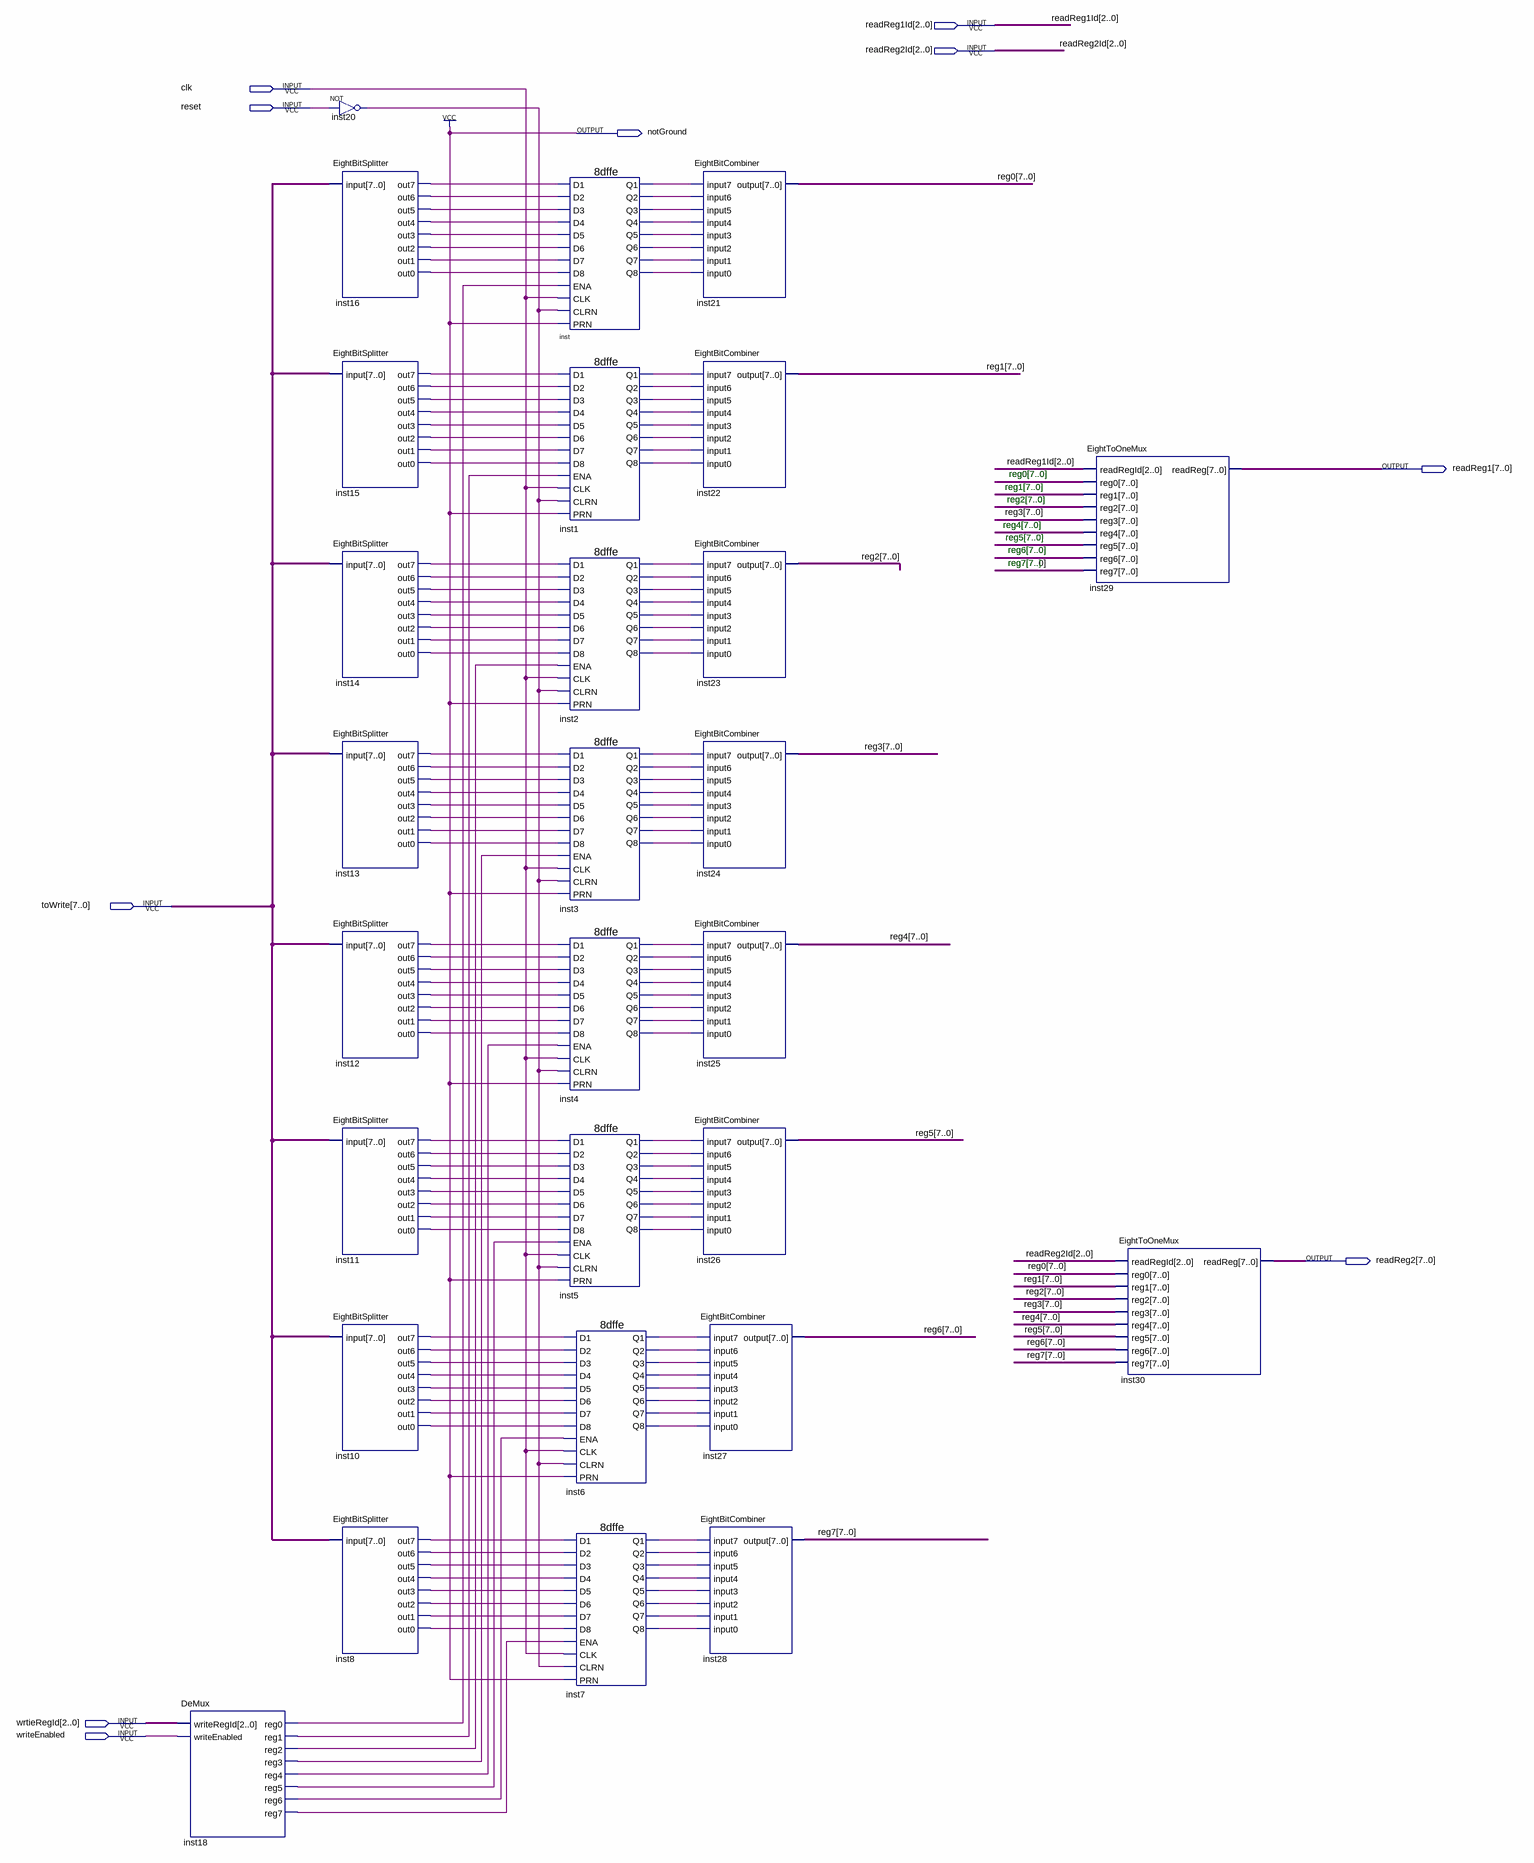
[diagram p0: schematic sheet]
// Quartus schematic RegisterFile.bdf as structural Verilog: 28 symbols, 10 pins
module RegisterFile (
  input  [2:0] readReg1Id,
  input  [2:0] readReg2Id,
  input  clk,
  input  reset,
  input  [7:0] toWrite,
  input  [2:0] wrtieRegId,
  input  writeEnabled,
  output notGround,
  output [7:0] readReg1,
  output [7:0] readReg2
);

  wire inst1_q1, inst1_q2, inst1_q3, inst1_q4, inst1_q5, inst1_q6, inst1_q7, inst1_q8, inst2_q1, inst2_q2,
       inst2_q3, inst2_q4, inst2_q5, inst2_q6, inst2_q7, inst2_q8, inst3_q1, inst3_q2, inst3_q3, inst3_q4,
       inst3_q5, inst3_q6, inst3_q7, inst3_q8, inst4_q1, inst4_q2, inst4_q3, inst4_q4, inst4_q5, inst4_q6,
       inst4_q7, inst4_q8, inst5_q1, inst5_q2, inst5_q3, inst5_q4, inst5_q5, inst5_q6, inst5_q7, inst5_q8,
       inst6_q1, inst6_q2, inst6_q3, inst6_q4, inst6_q5, inst6_q6, inst6_q7, inst6_q8, inst7_q1, inst7_q2,
       inst7_q3, inst7_q4, inst7_q5, inst7_q6, inst7_q7, inst7_q8, inst8_out0, inst8_out1, inst8_out2,
       inst8_out3, inst8_out4, inst8_out5, inst8_out6, inst8_out7, inst10_out0, inst10_out1, inst10_out2,
       inst10_out3, inst10_out4, inst10_out5, inst10_out6, inst10_out7, inst11_out0, inst11_out1,
       inst11_out2, inst11_out3, inst11_out4, inst11_out5, inst11_out6, inst11_out7, inst12_out0,
       inst12_out1, inst12_out2, inst12_out3, inst12_out4, inst12_out5, inst12_out6, inst12_out7,
       inst13_out0, inst13_out1, inst13_out2, inst13_out3, inst13_out4, inst13_out5, inst13_out6,
       inst13_out7, inst14_out0, inst14_out1, inst14_out2, inst14_out3, inst14_out4, inst14_out5,
       inst14_out6, inst14_out7, inst15_out0, inst15_out1, inst15_out2, inst15_out3, inst15_out4,
       inst15_out5, inst15_out6, inst15_out7, inst16_out0, inst16_out1, inst16_out2, inst16_out3,
       inst16_out4, inst16_out5, inst16_out6, inst16_out7, inst18_reg0, inst18_reg1, inst18_reg2,
       inst18_reg3, inst18_reg4, inst18_reg5, inst18_reg6, inst18_reg7, inst20_out, inst_q1, inst_q2,
       inst_q3, inst_q4, inst_q5, inst_q6, inst_q7, inst_q8;
  wire [7:0] reg0, reg1, reg2, reg3, reg4, reg5, reg6, reg7;

  DeMux inst18 (
    .writeRegId(wrtieRegId), .writeEnabled(writeEnabled), .reg0(inst18_reg0), .reg1(inst18_reg1),
    .reg2(inst18_reg2), .reg3(inst18_reg3), .reg4(inst18_reg4), .reg5(inst18_reg5), .reg6(inst18_reg6),
    .reg7(inst18_reg7));
  not inst20 (inst20_out, reset);
  EightBitSplitter inst16 (
    .\input (toWrite), .out7(inst16_out7), .out6(inst16_out6), .out5(inst16_out5), .out4(inst16_out4),
    .out3(inst16_out3), .out2(inst16_out2), .out1(inst16_out1), .out0(inst16_out0));
  EightBitSplitter inst15 (
    .\input (toWrite), .out7(inst15_out7), .out6(inst15_out6), .out5(inst15_out5), .out4(inst15_out4),
    .out3(inst15_out3), .out2(inst15_out2), .out1(inst15_out1), .out0(inst15_out0));
  EightBitSplitter inst14 (
    .\input (toWrite), .out7(inst14_out7), .out6(inst14_out6), .out5(inst14_out5), .out4(inst14_out4),
    .out3(inst14_out3), .out2(inst14_out2), .out1(inst14_out1), .out0(inst14_out0));
  EightBitSplitter inst13 (
    .\input (toWrite), .out7(inst13_out7), .out6(inst13_out6), .out5(inst13_out5), .out4(inst13_out4),
    .out3(inst13_out3), .out2(inst13_out2), .out1(inst13_out1), .out0(inst13_out0));
  EightBitSplitter inst12 (
    .\input (toWrite), .out7(inst12_out7), .out6(inst12_out6), .out5(inst12_out5), .out4(inst12_out4),
    .out3(inst12_out3), .out2(inst12_out2), .out1(inst12_out1), .out0(inst12_out0));
  EightBitSplitter inst11 (
    .\input (toWrite), .out7(inst11_out7), .out6(inst11_out6), .out5(inst11_out5), .out4(inst11_out4),
    .out3(inst11_out3), .out2(inst11_out2), .out1(inst11_out1), .out0(inst11_out0));
  EightBitSplitter inst10 (
    .\input (toWrite), .out7(inst10_out7), .out6(inst10_out6), .out5(inst10_out5), .out4(inst10_out4),
    .out3(inst10_out3), .out2(inst10_out2), .out1(inst10_out1), .out0(inst10_out0));
  EightBitSplitter inst8 (
    .\input (toWrite), .out7(inst8_out7), .out6(inst8_out6), .out5(inst8_out5), .out4(inst8_out4),
    .out3(inst8_out3), .out2(inst8_out2), .out1(inst8_out1), .out0(inst8_out0));
  \8dffe  inst (
    .CLRN(inst20_out), .D2(inst16_out6), .D3(inst16_out5), .D4(inst16_out4), .D5(inst16_out3),
    .D8(inst16_out0), .D6(inst16_out2), .D7(inst16_out1), .CLK(clk), .ENA(inst18_reg0), .D1(inst16_out7),
    .PRN(1'b1), .Q8(inst_q8), .Q4(inst_q4), .Q6(inst_q6), .Q7(inst_q7), .Q3(inst_q3), .Q2(inst_q2),
    .Q1(inst_q1), .Q5(inst_q5));
  \8dffe  inst1 (
    .CLRN(inst20_out), .D2(inst15_out6), .D3(inst15_out5), .D4(inst15_out4), .D5(inst15_out3),
    .D8(inst15_out0), .D6(inst15_out2), .D7(inst15_out1), .CLK(clk), .ENA(inst18_reg1), .D1(inst15_out7),
    .PRN(1'b1), .Q8(inst1_q8), .Q4(inst1_q4), .Q6(inst1_q6), .Q7(inst1_q7), .Q3(inst1_q3), .Q2(inst1_q2),
    .Q1(inst1_q1), .Q5(inst1_q5));
  \8dffe  inst2 (
    .CLRN(inst20_out), .D2(inst14_out6), .D3(inst14_out5), .D4(inst14_out4), .D5(inst14_out3),
    .D8(inst14_out0), .D6(inst14_out2), .D7(inst14_out1), .CLK(clk), .ENA(inst18_reg2), .D1(inst14_out7),
    .PRN(1'b1), .Q8(inst2_q8), .Q4(inst2_q4), .Q6(inst2_q6), .Q7(inst2_q7), .Q3(inst2_q3), .Q2(inst2_q2),
    .Q1(inst2_q1), .Q5(inst2_q5));
  \8dffe  inst3 (
    .CLRN(inst20_out), .D2(inst13_out6), .D3(inst13_out5), .D4(inst13_out4), .D5(inst13_out3),
    .D8(inst13_out0), .D6(inst13_out2), .D7(inst13_out1), .CLK(clk), .ENA(inst18_reg3), .D1(inst13_out7),
    .PRN(1'b1), .Q8(inst3_q8), .Q4(inst3_q4), .Q6(inst3_q6), .Q7(inst3_q7), .Q3(inst3_q3), .Q2(inst3_q2),
    .Q1(inst3_q1), .Q5(inst3_q5));
  \8dffe  inst4 (
    .CLRN(inst20_out), .D2(inst12_out6), .D3(inst12_out5), .D4(inst12_out4), .D5(inst12_out3),
    .D8(inst12_out0), .D6(inst12_out2), .D7(inst12_out1), .CLK(clk), .ENA(inst18_reg4), .D1(inst12_out7),
    .PRN(1'b1), .Q8(inst4_q8), .Q4(inst4_q4), .Q6(inst4_q6), .Q7(inst4_q7), .Q3(inst4_q3), .Q2(inst4_q2),
    .Q1(inst4_q1), .Q5(inst4_q5));
  \8dffe  inst5 (
    .CLRN(inst20_out), .D2(inst11_out6), .D3(inst11_out5), .D4(inst11_out4), .D5(inst11_out3),
    .D8(inst11_out0), .D6(inst11_out2), .D7(inst11_out1), .CLK(clk), .ENA(inst18_reg5), .D1(inst11_out7),
    .PRN(1'b1), .Q8(inst5_q8), .Q4(inst5_q4), .Q6(inst5_q6), .Q7(inst5_q7), .Q3(inst5_q3), .Q2(inst5_q2),
    .Q1(inst5_q1), .Q5(inst5_q5));
  \8dffe  inst6 (
    .CLRN(inst20_out), .D2(inst10_out6), .D3(inst10_out5), .D4(inst10_out4), .D5(inst10_out3),
    .D8(inst10_out0), .D6(inst10_out2), .D7(inst10_out1), .CLK(clk), .ENA(inst18_reg6), .D1(inst10_out7),
    .PRN(1'b1), .Q8(inst6_q8), .Q4(inst6_q4), .Q6(inst6_q6), .Q7(inst6_q7), .Q3(inst6_q3), .Q2(inst6_q2),
    .Q1(inst6_q1), .Q5(inst6_q5));
  \8dffe  inst7 (
    .CLRN(inst20_out), .D2(inst8_out6), .D3(inst8_out5), .D4(inst8_out4), .D5(inst8_out3), .D8(inst8_out0),
    .D6(inst8_out2), .D7(inst8_out1), .CLK(clk), .ENA(inst18_reg7), .D1(inst8_out7), .PRN(1'b1),
    .Q8(inst7_q8), .Q4(inst7_q4), .Q6(inst7_q6), .Q7(inst7_q7), .Q3(inst7_q3), .Q2(inst7_q2), .Q1(inst7_q1),
    .Q5(inst7_q5));
  EightBitCombiner inst21 (
    .input7(inst_q1), .input6(inst_q2), .input5(inst_q3), .input4(inst_q4), .input3(inst_q5),
    .input2(inst_q6), .input1(inst_q7), .input0(inst_q8), .\output (reg0));
  EightBitCombiner inst22 (
    .input7(inst1_q1), .input6(inst1_q2), .input5(inst1_q3), .input4(inst1_q4), .input3(inst1_q5),
    .input2(inst1_q6), .input1(inst1_q7), .input0(inst1_q8), .\output (reg1));
  EightBitCombiner inst23 (
    .input7(inst2_q1), .input6(inst2_q2), .input5(inst2_q3), .input4(inst2_q4), .input3(inst2_q5),
    .input2(inst2_q6), .input1(inst2_q7), .input0(inst2_q8), .\output (reg2));
  EightBitCombiner inst24 (
    .input7(inst3_q1), .input6(inst3_q2), .input5(inst3_q3), .input4(inst3_q4), .input3(inst3_q5),
    .input2(inst3_q6), .input1(inst3_q7), .input0(inst3_q8), .\output (reg3));
  EightBitCombiner inst25 (
    .input7(inst4_q1), .input6(inst4_q2), .input5(inst4_q3), .input4(inst4_q4), .input3(inst4_q5),
    .input2(inst4_q6), .input1(inst4_q7), .input0(inst4_q8), .\output (reg4));
  EightBitCombiner inst26 (
    .input7(inst5_q1), .input6(inst5_q2), .input5(inst5_q3), .input4(inst5_q4), .input3(inst5_q5),
    .input2(inst5_q6), .input1(inst5_q7), .input0(inst5_q8), .\output (reg5));
  EightBitCombiner inst27 (
    .input7(inst6_q1), .input6(inst6_q2), .input5(inst6_q3), .input4(inst6_q4), .input3(inst6_q5),
    .input2(inst6_q6), .input1(inst6_q7), .input0(inst6_q8), .\output (reg6));
  EightBitCombiner inst28 (
    .input7(inst7_q1), .input6(inst7_q2), .input5(inst7_q3), .input4(inst7_q4), .input3(inst7_q5),
    .input2(inst7_q6), .input1(inst7_q7), .input0(inst7_q8), .\output (reg7));
  EightToOneMux inst29 (
    .readRegId(readReg1Id), .reg0(reg0), .reg1(reg1), .reg2(reg2), .reg3(reg3), .reg4(reg4), .reg5(reg5),
    .reg6(reg6), .reg7(reg7), .readReg(readReg1));
  EightToOneMux inst30 (
    .readRegId(readReg2Id), .reg0(reg0), .reg1(reg1), .reg2(reg2), .reg3(reg3), .reg4(reg4), .reg5(reg5),
    .reg6(reg6), .reg7(reg7), .readReg(readReg2));

  assign notGround = 1'b1;

  // Notes on the sheet:
  //   reg0[7..0]
  //   reg1[7..0]
  //   reg2[7..0]
  //   reg4[7..0]
  //   reg5[7..0]
  //   reg6[7..0]
  //   reg7[7..]
endmodule
